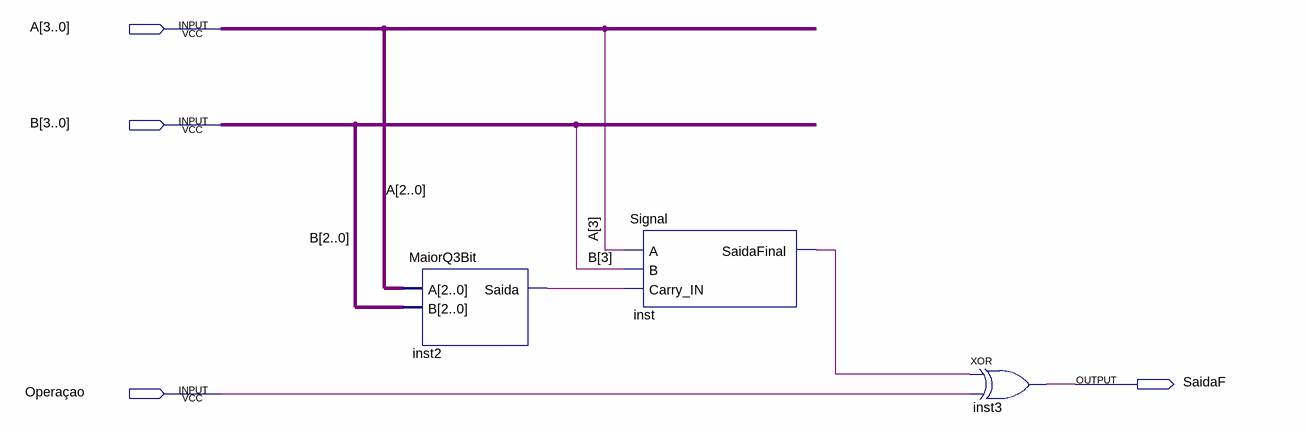
[diagram p0: schematic sheet]
// Quartus schematic MaiorQ4Bit.bdf as structural Verilog: 3 symbols, 4 pins
module MaiorQ4Bit (
  input  [3:0] A,
  input  [3:0] B,
  input  \Operaçao ,
  output SaidaF
);

  wire inst2_saida, inst_saidafinal;

  MaiorQ3Bit inst2 (.A(A[2:0]), .B(B[2:0]), .Saida(inst2_saida));
  Signal inst (.A(A[3]), .Carry_IN(inst2_saida), .B(B[3]), .SaidaFinal(inst_saidafinal));
  xor inst3 (SaidaF, inst_saidafinal, \Operaçao );
endmodule
